# Altium schematic sheet TPS54622_Schematic.SchDoc
size A
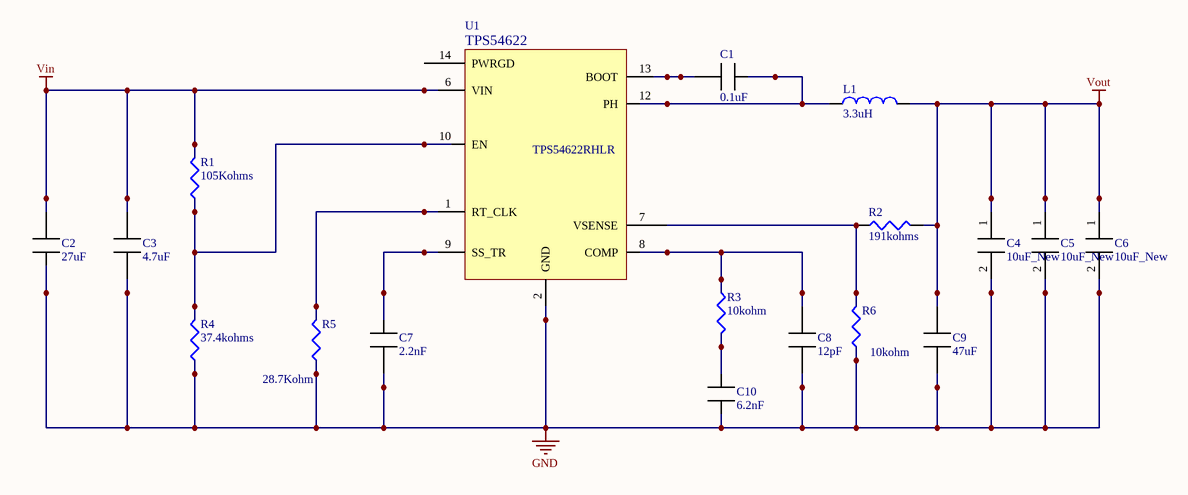
[diagram p0: TPS54622_Schematic.SchDoc]

## Parts
C1  0.1uF  [C/R0805]
C2  27uF  [CAPAE430X550N]
C3  4.7uF  [C/R0805]
C4  10uF_New  [CAPPM7343X310N]
C5  10uF_New  [CAPPM7343X310N]
C6  10uF_New  [CAPPM7343X310N]
C7  2.2nF  [C/R0805]
C8  12pF  [C/R0805]
C9  47uF  [C/R0805]
C10  6.2nF  [C/R0805]
L1  3.3uH  [C/R0805]
R1  105Kohms  [C/R0805]
R2  191kohms  [C/R0805]
R3  10kohm  [C/R0805]
R4  37.4kohms  [C/R0805]
R5  28.7Kohm  [C/R0805]
R6  10kohm  [C/R0805]
U1  TPS54622RHLR  [QFN50P350X350X100-15N]

## Nets
GND: C2.1 C3.1 C4.2 C5.2 C6.2 C7.1 C8.2 C9.1 C10.1 R4.1 R5.1 R6.1 U1.2(GND)
Vin: C2.2 C3.2 R1.2 U1.6(VIN)
Vout: C4.1 C5.1 C6.1 C9.2 L1.2 R2.2
NetC1_1: C1.1 U1.13(BOOT)
NetC1_2: C1.2 L1.1 U1.12(PH)
NetC7_2: C7.2 U1.9(SS_TR)
NetC8_1: C8.1 R3.1 U1.8(COMP)
NetC10_2: C10.2 R3.2
NetR1_1: R1.1 R4.2 U1.10(EN)
NetR2_1: R2.1 R6.2 U1.7(VSENSE)
NetR5_2: R5.2 U1.1(RT_CLK)

Not connected (* = marked no-connect by the designer): U1 14(PWRGD)

## Notes on the sheet
- (in symbol TPS54622RHLR) TPS54622

## Library data of the parts
C1 = C0805C104Z5VACTU: KEMET         C0805C104Z5VACTU.             CERAMIC CAPACITOR, 0.1UF, 50V, Y5V, +80,-20%, 0805; Ceramic Capacitor Case: 0805 [2012 Metric]; Capacitance: 0.1µF; Capacitance Tolerance: +80%, -20%; Product Range: C Series; SVHC: No SVHC (15-Jun-2015); Supplier 1: Digi-Key; Manufacturer: KEMET; Manufacturer Part Number: C0805C104Z5VACTU; Stock 1: 1249727; Pricing 1: 1=0.1, 10=0.057, 100=0.0254, 500=0.0182, 1000=0.0143 (USD); Voltage Rating: 50V; Dielectric Characteristic: Y5V; Packaging: Cut Tape; Operating Temperature Min: -30°C; Operating Temperature Max: 85°C; Automotive Qualification Standard: -; MSL: MSL 1 - Unlimited; ComponentLink1URL: http://www.alliedelec.com/m/d/9bfe7773041ffe9d406e68bc7b377fdd.pdf?src-supplier=Allied+Electronics; ComponentLink1Description: http://www.alliedelec.com/m/d/9bfe7773041ffe9d406e68bc7b377fdd.pdf?src-supplier=Allied+Electronics; ComponentLink2URL: https://www.verical.com/server-webapp/html/getDatasheet?partID=37101&src-supplier=Verical; ComponentLink2Description: https://www.verical.com/server-webapp/html/getDatasheet?partID=37101&src-supplier=Verical; ComponentLink3URL: https://www.verical.com/server-webapp/html/getDatasheet?partID=321176&src-supplier=Verical; ComponentLink3Description: https://www.verical.com/server-webapp/html/getDatasheet?partID=321176&src-supplier=Verical; ComponentLink4URL: http://www.farnell.com/datasheets/2123124.pdf?src-supplier=Element14; ComponentLink4Description: http://www.farnell.com/datasheets/2123124.pdf?src-supplier=Element14
C2 = 25SVPF27MX: CAP ALUM POLY 27UF 20% 25V SMD; Manufacturer: Panasonic; SVHC: To Be Advised; Product Range: PANASONIC - SVPF Series; Capacitance: 27µF; Capacitor Case Style: Radial Can - SMD; ESR: 0.04ohm; Ripple Current AC: 2.45A; Life Time @ Temperature: 5000 hours @ 105°C; Supplier 1: Digi-Key; Manufacturer Part Number: 25SVPF27MX; Stock 1: 1154; Pricing 1: 1=1.02, 10=0.809, 100=0.6065, 500=0.4583 (USD); Capacitance Tolerance: ± 20%; Voltage Rating: 25V; Diameter: 5mm; Height: 5.9mm; Packaging: Cut Tape; Operating Temperature Min: -55°C; Operating Temperature Max: 105°C; ComponentLink1URL: http://www.mouser.com/ds/2/315/AAB8000C177-947360.pdf?src-supplier=Mouser; ComponentLink1Description: http://www.mouser.com/ds/2/315/AAB8000C177-947360.pdf?src-supplier=Mouser; ComponentLink2URL: http://www.farnell.com/datasheets/1734360.pdf?src-supplier=Element14; ComponentLink2Description: http://www.farnell.com/datasheets/1734360.pdf?src-supplier=Element14; ComponentLink3URL: http://www.alliedelec.com/m/d/9b7b01c855a68cc875be7e3560c8e95f.pdf?src-supplier=Allied+Electronics; ComponentLink3Description: http://www.alliedelec.com/m/d/9b7b01c855a68cc875be7e3560c8e95f.pdf?src-supplier=Allied+Electronics; ComponentLink4URL: http://www.farnell.com/datasheets/2059634.pdf?src-supplier=Farnell; ComponentLink4Description: http://www.farnell.com/datasheets/2059634.pdf?src-supplier=Farnell
C3 = CC0805ZRY5V6BB475: CAP CER 4.7UF 10V Y5V 0805; Manufacturer: Yageo; Product Training Modules: Multilayer Ceramic Capacitors High Capacitance MLCCs; Featured Product: Yageo - High Capacitance MLCC; Capacitance: 4.7µF; Tolerance: -20%, +80%; Temperature Coefficient: Y5V (F); Online Catalog: CC Series; Other Names: 311-1371-6; Supplier 1: Digi-Key; Manufacturer Part Number: CC0805ZRY5V6BB475; Stock 1: 117685; Pricing 1: 1=0.19, 10=0.132, 100=0.0667, 500=0.0456, 1000=0.0404 (USD); Standard Package: 1; Category: Capacitors; Family: Ceramic Capacitors; Series: CC; Packaging: Digi-Reel®; Voltage - Rated: 10V; Mounting Type: Surface Mount, MLCC; Operating Temperature: -30°C ~ 85°C; Applications: General Purpose; Ratings: -; Package / Case: 0805 (2012 Metric); Size / Dimension: 0.079" L x 0.049" W (2.00mm x 1.25mm); Height - Seated (Max): -; Thickness (Max): 0.033" (0.85mm); Lead Spacing: -; Features: -; Lead Style: -; ComponentLink1URL: http://www.yageo.com/documents/recent/UPY-GPHC_Y5V_6.3V-to-50V_8.pdf?src-supplier=Digi-Key; ComponentLink1Description: http://www.yageo.com/documents/recent/UPY-GPHC_Y5V_6.3V-to-50V_8.pdf?src-supplier=Digi-Key; ComponentLink2URL: https://www.verical.com/server-webapp/html/getDatasheet?partID=251807&src-supplier=Verical; ComponentLink2Description: https://www.verical.com/server-webapp/html/getDatasheet?partID=251807&src-supplier=Verical; ComponentLink3URL: http://www.yageo.com/documents/recent/UPY-GPHC_Y5V_6.3V-to-50V_5.pdf?src-supplier=Avnet; ComponentLink3Description: http://www.yageo.com/documents/recent/UPY-GPHC_Y5V_6.3V-to-50V_5.pdf?src-supplier=Avnet; ComponentLink4URL: http://www.yageo.com/documents/recent/UPY-GPHC_Y5V_6.3V-to-50V_5.pdf?src-supplier=Avnet+Europe; ComponentLink4Description: http://www.yageo.com/documents/recent/UPY-GPHC_Y5V_6.3V-to-50V_5.pdf?src-supplier=Avnet+Europe; ComponentLink5URL: http://www.farnell.com/datasheets/1132289.pdf?src-supplier=Element14; ComponentLink5Description: http://www.farnell.com/datasheets/1132289.pdf?src-supplier=Element14; ComponentLink6URL: http://www.mouser.com/ds/2/447/Yageo_UPY-GP_NP0_16V-to-50V_9-358835.pdf?src-supplier=Mouser; ComponentLink6Description: http://www.mouser.com/ds/2/447/Yageo_UPY-GP_NP0_16V-to-50V_9-358835.pdf?src-supplier=Mouser; ComponentLink7URL: http://www.yageo.com/documents/recent/UPY-GPHC_Y5V_6.3V-to-50V_5_revised.pdf?src-supplier=Future+Electronics; ComponentLink7Description: http://www.yageo.com/documents/recent/UPY-GPHC_Y5V_6.3V-to-50V_5_revised.pdf?src-supplier=Future+Electronics
C4-C6 = T495D106M035ATE125: CAP TANT 10UF 35V 20% 2917; Manufacturer: KEMET; Product Range: KEMET - T495 Series; Capacitance: 10µF; Capacitor Case Style: 2917 ^7343 Metric]; ESR: 0.125ohm; Supplier 1: Digi-Key; Manufacturer Part Number: T495D106M035ATE125; Stock 1: 5675; Pricing 1: 1=1.79, 10=1.449, 100=1.1066 (USD); Packaging: Full Reel; Capacitance Tolerance: ± 20%; Voltage Rating: 35V; Operating Temperature Max: 125°C; Operating Temperature Min: -55°C; ComponentLink1URL: https://www.verical.com/server-webapp/html/getDatasheet?partID=44813&src-supplier=Verical; ComponentLink1Description: https://www.verical.com/server-webapp/html/getDatasheet?partID=44813&src-supplier=Verical; ComponentLink2URL: http://www.farnell.com/datasheets/1761160.pdf?src-supplier=Element14; ComponentLink2Description: http://www.farnell.com/datasheets/1761160.pdf?src-supplier=Element14; ComponentLink3URL: http://www.farnell.com/datasheets/1744560.pdf?src-supplier=Element14; ComponentLink3Description: http://www.farnell.com/datasheets/1744560.pdf?src-supplier=Element14
C7 = C0805C222K5RAC: Cap Ceramic 0.0022uF 50V X7R 10% Pad SMD 0805 125C Bulk; Manufacturer: KEMET; Construction form: 0805; Rated voltage: 50VDC; Supplier 1: Mouser; Manufacturer Part Number: C0805C222K5RAC; Stock 1: 148000; Pricing 1: 4000=0.009, 8000=0.008, 24000=0.007, 48000=0.006 (USD); Capacitance: 2.2nF; Capacitance tolerance: ±10%; Ceramic type: X7R; Temperature range: -55...+125°C; ComponentLink1URL: https://www1.elfa.se/data1/wwwroot/assets/datasheets/slCeramic-Chip-Condensers_e.pdf?src-supplier=Distrelec; ComponentLink1Description: https://www1.elfa.se/data1/wwwroot/assets/datasheets/slCeramic-Chip-Condensers_e.pdf?src-supplier=Distrelec
C8 = CC0805JRNPO9BN120: CAP CER 12PF 50V C0G/NPO 0805; Manufacturer: Yageo; Product Training Modules: Multilayer Ceramic Capacitors; Catalog Drawings: CC_0805_0.6; Featured Product: Commodity Multilayer Ceramic Capacitors – CC Series; Tolerance: ±5%; Temperature Coefficient: C0G, NP0; Online Catalog: CC Series; Other Names: 311-1100-6 311-1296-6 311-1296-6-ND; Supplier 1: Digi-Key; Manufacturer Part Number: CC0805JRNPO9BN120; Stock 1: 77774; Pricing 1: 1=0.11, 10=0.079, 100=0.0351, 500=0.0251, 1000=0.0197 (USD); Standard Package: 1; Category: Capacitors; Family: Ceramic Capacitors; Series: CC; Packaging: Digi-Reel®; Capacitance: 12pF; Voltage - Rated: 50V; Mounting Type: Surface Mount, MLCC; Operating Temperature: -55°C ~ 125°C; Applications: General Purpose; Ratings: -; Package / Case: 0805 (2012 Metric); Size / Dimension: 0.079" L x 0.049" W (2.00mm x 1.25mm); Height - Seated (Max): -; Thickness (Max): 0.024" (0.60mm); Lead Spacing: -; Features: -; Lead Style: -; ComponentLink1URL: https://www.verical.com/server-webapp/html/getDatasheet?partID=38285&src-supplier=Verical; ComponentLink1Description: https://www.verical.com/server-webapp/html/getDatasheet?partID=38285&src-supplier=Verical; ComponentLink2URL: http://www.yageo.com/documents/recent/UPY-GP_NP0_16V-to-50V_16.pdf?src-supplier=Digi-Key; ComponentLink2Description: http://www.yageo.com/documents/recent/UPY-GP_NP0_16V-to-50V_16.pdf?src-supplier=Digi-Key; ComponentLink3URL: http://www.yageo.com/documents/recent/UPY-GP_NP0_16V-to-50V_8.pdf?src-supplier=Avnet; ComponentLink3Description: http://www.yageo.com/documents/recent/UPY-GP_NP0_16V-to-50V_8.pdf?src-supplier=Avnet; ComponentLink4URL: http://www.yageo.com/documents/recent/UPY-GP_NP0_16V-to-50V_8.pdf?src-supplier=Avnet+Europe; ComponentLink4Description: http://www.yageo.com/documents/recent/UPY-GP_NP0_16V-to-50V_8.pdf?src-supplier=Avnet+Europe; ComponentLink5URL: https://produktinfo.conrad.com/datenblaetter/425000-449999/445317-da-01-en-KERKO_CHIP_0805_NP0_12pF_5Proz_50V_G.pdf?src-supplier=Conrad; ComponentLink5Description: https://produktinfo.conrad.com/datenblaetter/425000-449999/445317-da-01-en-KERKO_CHIP_0805_NP0_12pF_5Proz_50V_G.pdf?src-supplier=Conrad
C9 = GRM21BR60J476ME15K: 47µF 6.3V Ceramic Capacitor X5R 0805 (2012 Metric) 0.079" L x 0.049" W (2.00mm x 1.25mm); Manufacturer: Murata; Categories: Capacitors; Tolerance: ±20%; Supplier 1: Digi-Key; Manufacturer Part Number: GRM21BR60J476ME15K; Stock 1: 16666; Pricing 1: 1=0.48, 10=0.339, 100=0.2236, 500=0.1656, 1000=0.1408, 2500=0.1325, 5000=0.1242 (USD); Series: GRM; Packaging: Tape & Reel (TR); Part Status: Not For New Designs; Capacitance: 47µF; Voltage - Rated: 6.3V; Temperature Coefficient: X5R; Operating Temperature: -55°C ~ 85°C; Features: -; Ratings: -; Applications: General Purpose; Mounting Type: Surface Mount, MLCC; Package / Case: 0805 (2012 Metric); Size / Dimension: 0.079 L x 0.049 W (2.00mm x 1.25mm); Height - Seated (Max): -; Thickness (Max): 0.057 (1.45mm); Lead Spacing: -; Lead Style: -; ComponentLink1URL: http://www.mouser.com/ds/2/281/c02e-2905.pdf?src-supplier=Mouser; ComponentLink1Description: http://www.mouser.com/ds/2/281/c02e-2905.pdf?src-supplier=Mouser; ComponentLink2URL: https://search.murata.co.jp/Ceramy/image/img/A01X/G101/ENG/GRM21BR60J476ME15-01.pdf?src-supplier=Digi-Key; ComponentLink2Description: https://search.murata.co.jp/Ceramy/image/img/A01X/G101/ENG/GRM21BR60J476ME15-01.pdf?src-supplier=Digi-Key
C10 = GRM2195C1H622JA01D: CAP CER 6200PF 50V C0G/NP0 0805; Manufacturer: Murata; Rad Hard: No; Capacitance Value: 0.0062 uF; Voltage: 50 Vdc; Tolerance: 5 %; Dielectric: C0G; Product Length: 2 mm; Product Height: 0.85 mm; Product Depth: 1.25 mm; Supplier 1: Digi-Key; Manufacturer Part Number: GRM2195C1H622JA01D; Stock 1: 21992; Pricing 1: 1=0.32, 10=0.219, 100=0.124, 500=0.0875, 1000=0.0766 (USD); Packaging: Tape & Reel; Package/Case: 0805; Mounting: Surface Mount; Operating Temperature: -55 to 125 °C; Construction: Flat; Category: Capacitor Ceramic Multilayer; ComponentLink1URL: https://www.murata.com/~/media/webrenewal/support/library/catalog/products/capacitor/mlcc/c02e.ashx?la=en-us&src-supplier=Digi-Key; ComponentLink1Description: https://www.murata.com/~/media/webrenewal/support/library/catalog/products/capacitor/mlcc/c02e.ashx?la=en-us&src-supplier=Digi-Key; ComponentLink2URL: http://www.mouser.com/ds/2/281/c02e-2905.pdf?src-supplier=Mouser; ComponentLink2Description: http://www.mouser.com/ds/2/281/c02e-2905.pdf?src-supplier=Mouser
L1 = BRC2012T3R3MD: INDUCTOR, 3.3UH, 870MA, 20%, 300MHZ; Core Material:Ferrite; DC Current Rating:870mA; DC Resistance Max:0.17ohm; Inductance:3.3µH; Inductance Tolerance:± 20%; Inductor Case Style:0805; Lead Spacing:1mm; No. of Pins:2 ;RoHS Compliant: Yes; Manufacturer: Taiyo Yuden; EDA / CAD Models: Download from Accelerated Designs; Type: Wirewound; Inductance: 3.3µH; Current - Saturation: 800mA; Shielding: Unshielded; DC Resistance (DCR): 221 mOhm Max; Frequency - Test: 1MHz; Online Catalog: BR Series; Other Names: 587-2906-2 / BR C2012T3R3MD / LQ BR C2012T3R3MD; Supplier 1: Digi-Key; Manufacturer Part Number: BRC2012T3R3MD; Stock 1: 19368; Pricing 1: 1=0.35, 10=0.308, 100=0.2119, 500=0.1811, 1000=0.1387 (USD); Standard Package: 2,000; Category: Inductors, Coils, Chokes; Family: Fixed Inductors; Series: BR; Packaging: Tape & Reel (TR); Tolerance: ±20%; Current Rating: 870mA; Frequency - Self Resonant: 300MHz; Operating Temperature: -40°C ~ 105°C; Mounting Type: Surface Mount; Package / Case: 0805 (2012 Metric); Size / Dimension: 0.079" L x 0.049" W (2.00mm x 1.25mm); Height - Seated (Max): 0.055" (1.40mm); ComponentLink1URL: https://www.verical.com/server-webapp/html/getDatasheet?partID=639073&src-supplier=Verical; ComponentLink1Description: https://www.verical.com/server-webapp/html/getDatasheet?partID=639073&src-supplier=Verical; ComponentLink2URL: http://www.yuden.co.jp/ut/product/category/inductor/BRC2012T3R3MD.pdf?src-supplier=Newark; ComponentLink2Description: http://www.yuden.co.jp/ut/product/category/inductor/BRC2012T3R3MD.pdf?src-supplier=Newark; ComponentLink3URL: http://ds.yuden.co.jp/TYCOMPAS/ut/detail.do?productNo=BRC2012T3R3MD&fileName=BRC2012T3R3MD_SS&mode=specSheetDownload&src-supplier=Digi-Key; ComponentLink3Description: http://ds.yuden.co.jp/TYCOMPAS/ut/detail.do?productNo=BRC2012T3R3MD&fileName=BRC2012T3R3MD_SS&mode=specSheetDownload&src-supplier=Digi-Key; ComponentLink4URL: http://documents.rs-components.com/techlib://itc_doclist_GB.htm?stockno=7557540&src-supplier=RSComponents; ComponentLink4Description: http://documents.rs-components.com/techlib://itc_doclist_GB.htm?stockno=7557540&src-supplier=RSComponents
R1 = ERA-6AEB1053V: RESISTOR, 0805, 105K, 0.1%, 0.125W; Manufacturer: Panasonic; Power Rating: 125mW; Resistor Case Style: 0805 [2012 Metric]; Resistor Element Material: Thin Film; Temperature Coefficient: ± 25ppm/°C; Voltage Rating: 100V; External Depth: 1.25mm; External Length / Height: 0.5mm; External Width: 2mm; No. of Pins: 2; Product Range: PANASONIC - ERA; Resistor Mounting: SMD; Supplier 1: Digi-Key; Manufacturer Part Number: ERA-6AEB1053V; Stock 1: 9772; Pricing 1: 1=0.36, 10=0.302, 100=0.1182, 1000=0.0495, 2500=0.0454 (USD); Resistance: 105kohm; Resistance Tolerance: ± 0.1%; Operating Temperature Max: 155°C; Operating Temperature Min: -55°C; Operating Temperature Range: -55°C to +155°C; Packaging: Reel; Series: ERA; ComponentLink1URL: http://uk.rs-online.com/webdocs/0eb1/0900766b80eb1d8c.pdf?src-supplier=RSComponents; ComponentLink1Description: http://uk.rs-online.com/webdocs/0eb1/0900766b80eb1d8c.pdf?src-supplier=RSComponents; ComponentLink2URL: http://www.farnell.com/datasheets/485442.pdf?src-supplier=Farnell; ComponentLink2Description: http://www.farnell.com/datasheets/485442.pdf?src-supplier=Farnell; ComponentLink3URL: http://industrial.panasonic.com/www-data/pdf/AOA0000/AOA0000CE26.pdf?src-supplier=Avnet+Europe; ComponentLink3Description: http://industrial.panasonic.com/www-data/pdf/AOA0000/AOA0000CE26.pdf?src-supplier=Avnet+Europe; ComponentLink4URL: http://www.farnell.com/datasheets/485442.pdf?src-supplier=Element14; ComponentLink4Description: http://www.farnell.com/datasheets/485442.pdf?src-supplier=Element14; ComponentLink5URL: http://www.produktinfo.conrad.com/datenblaetter/1100000-1199999/001181353-da-01-en-WIDERSTAND_ERA_0805_105K_0_1__5000ST.pdf?src-supplier=Conrad; ComponentLink5Description: http://www.produktinfo.conrad.com/datenblaetter/1100000-1199999/001181353-da-01-en-WIDERSTAND_ERA_0805_105K_0_1__5000ST.pdf?src-supplier=Conrad
R2 = ERA-6AEB1913V: Res Thin Film 0805 191K Ohm 0.1% 1/8W 25ppm/C Molded SMD Punched Carrier T/R; Manufacturer: Panasonic; Power Rating: 125mW; Resistor Case Style: 0805 [2012 Metric]; Temperature Coefficient: ± 25ppm/°C; Voltage Rating: 100V; External Depth: 1.25mm; External Length / Height: 0.5mm; External Width: 2mm; No. of Pins: 2; Product Range: PANASONIC - ERA; Supplier 1: Digi-Key; Manufacturer Part Number: ERA-6AEB1913V; Stock 1: 6723; Pricing 1: 1=0.36, 10=0.302, 100=0.1182, 1000=0.0495, 2500=0.0454 (USD); Resistance: 191kohm; Resistance Tolerance: ± 0.1%; Resistor Element Material: Thin Film; Operating Temperature Max: 155°C; Operating Temperature Min: -55°C; Operating Temperature Range: -55°C to +155°C; Packaging: Reel; Resistor Mounting: SMD; Series: ERA; ComponentLink1URL: http://www.farnell.com/datasheets/485442.pdf?src-supplier=Farnell; ComponentLink1Description: http://www.farnell.com/datasheets/485442.pdf?src-supplier=Farnell; ComponentLink2URL: http://uk.rs-online.com/webdocs/0eb1/0900766b80eb1d8c.pdf?src-supplier=RSComponents; ComponentLink2Description: http://uk.rs-online.com/webdocs/0eb1/0900766b80eb1d8c.pdf?src-supplier=RSComponents; ComponentLink3URL: http://industrial.panasonic.com/www-data/pdf/AOA0000/AOA0000CE26.pdf?src-supplier=Avnet; ComponentLink3Description: http://industrial.panasonic.com/www-data/pdf/AOA0000/AOA0000CE26.pdf?src-supplier=Avnet; ComponentLink4URL: http://www.produktinfo.conrad.com/datenblaetter/1100000-1199999/001181370-da-01-en-WIDERSTAND_ERA_0805_191K_0_1__5000ST.pdf?src-supplier=Conrad; ComponentLink4Description: http://www.produktinfo.conrad.com/datenblaetter/1100000-1199999/001181370-da-01-en-WIDERSTAND_ERA_0805_191K_0_1__5000ST.pdf?src-supplier=Conrad
R3 R6 = LTR10EZPJ103: RES SMD 10K OHM 1/4W 0805 WIDE; Manufacturer: Rohm; EDA / CAD Models: Download from Accelerated Designs; Tolerance: ±5%; Power (Watts): 0.25W, 1/4W; Temperature Coefficient: ±200ppm/°C; Online Catalog: LTR10 Series; Other Names: RHM10KBUTR; Supplier 1: Digi-Key; Manufacturer Part Number: LTR10EZPJ103; Stock 1: 1415; Pricing 1: 1=0.15, 10=0.131, 100=0.0502, 1000=0.0221, 2500=0.0191 (USD); Standard Package: 5,000; Category: Resistors; Family: Chip Resistor - Surface Mount; Series: LTR; Packaging: Tape & Reel (TR); Resistance (Ohms): 10k; Composition: Thick Film; Features: Automotive AEC-Q200, Pulse Withstanding; Operating Temperature: -55°C ~ 155°C; Package / Case: Wide 0805 (2012 Metric), 0508; Supplier Device Package: 0805 (2012 Metric); Size / Dimension: 0.047" L x 0.079" W (1.20mm x 2.00mm); Height: 0.026" (0.65mm); Number of Terminations: 2; ComponentLink1URL: http://www.rohm.com/web/global/datasheet/LTR100JZPD/ltr-e?src-supplier=Digi-Key; ComponentLink1Description: http://www.rohm.com/web/global/datasheet/LTR100JZPD/ltr-e?src-supplier=Digi-Key
R4 = ERA6AEB3742V: Metal film resistor 37.4 kΩ SMD 0805 0.125 W; Manufacturer: Panasonic; Resistor Terminals: –; Power Rating: 125mW; Resistance Tolerance: ± 0.1%; Resistor Case Style: 0805 [2012 Metric]; Resistor Element Material: Thin Film; Temperature Coefficient: ± 25ppm/°C; Voltage Rating: 100V; External Depth: 1.25mm; External Length / Height: 0.5mm; External Width: 2mm; No. of Pins: 2; Product Range: PANASONIC - ERA; Supplier 1: Digi-Key; Manufacturer Part Number: ERA6AEB3742V; Stock 1: 34770; Pricing 1: 1=0.36, 10=0.302, 100=0.1182, 1000=0.0495, 2500=0.0454 (USD); MSL: –; SVHC: –; Resistance: 37.4kohm; Operating Temperature Max: 155°C; Operating Temperature Min: -55??C; Operating Temperature Range: -55°C to +155°C; Packaging: Reel; Resistor Mounting: SMD; Series: ERA; ComponentLink1URL: http://www.farnell.com/datasheets/485442.pdf?src-supplier=Farnell; ComponentLink1Description: http://www.farnell.com/datasheets/485442.pdf?src-supplier=Farnell; ComponentLink2URL: http://uk.rs-online.com/webdocs/0eb1/0900766b80eb1d8c.pdf?src-supplier=RSComponents; ComponentLink2Description: http://uk.rs-online.com/webdocs/0eb1/0900766b80eb1d8c.pdf?src-supplier=RSComponents; ComponentLink3URL: http://industrial.panasonic.com/www-data/pdf/AOA0000/AOA0000CE26.pdf?src-supplier=Avnet+Europe; ComponentLink3Description: http://industrial.panasonic.com/www-data/pdf/AOA0000/AOA0000CE26.pdf?src-supplier=Avnet+Europe; ComponentLink4URL: https://produktinfo.conrad.com/datenblaetter/450000-474999/458559-da-01-en-WIDERSTAND_0805_ERA.pdf?src-supplier=Conrad; ComponentLink4Description: https://produktinfo.conrad.com/datenblaetter/450000-474999/458559-da-01-en-WIDERSTAND_0805_ERA.pdf?src-supplier=Conrad
R5 = RG2012P-2872-B-T5: RES SMD 28.7K OHM 0.1% 1/8W 0805; Manufacturer: Susumu; Resistance: 28.7 kOhms; Power Rating: 100 mW; Temperature Coefficient: 25 PPM / C; Voltage Rating: 100 V; Case Height: 0.4 mm; Case Length: 2 mm; Case Width: 1.25 mm; Supplier 1: Digi-Key; Manufacturer Part Number: RG2012P-2872-B-T5; Stock 1: 18308; Pricing 1: 1=0.41, 10=0.318, 100=0.1336, 1000=0.0737, 2500=0.0691 (USD); Termination Style: SMD/SMT; Dimensions: 1.25 mm W x 2 mm L x 0.4 mm H; Product Category: Thin Film Resistors - SMD; RoHS: Details; Tolerance: 0.1 %; Case Code - in: 0805; Case Code - mm: 2012; Operating Temperature Range: - 55 C to + 155 C; Brand: Susumu; Package / Case: 0805 (2012 metric); Packaging: Reel; Product: Precision Resistors Thin Film SMD; Series: RG; Factory Pack Quantity: 5000; ComponentLink1URL: http://www.susumu.co.jp/common/pdf/n_catalog_partition01_en.pdf?src-supplier=Digi-Key; ComponentLink1Description: http://www.susumu.co.jp/common/pdf/n_catalog_partition01_en.pdf?src-supplier=Digi-Key; ComponentLink2URL: http://www.susumu-usa.com/pdf/RG_RM_RGH_DATASHEET.pdf?src-supplier=Future+Electronics; ComponentLink2Description: http://www.susumu-usa.com/pdf/RG_RM_RGH_DATASHEET.pdf?src-supplier=Future+Electronics
U1 = TPS54622RHLR: IC REG BUCK ADJ 6A SYNC 14QFN; Manufacturer: Texas Instruments; Product Training Modules: Telecom Point of Load Solutions; Featured Product: WEBENCH Design Center; Output Type: Adjustable; Number of Outputs: 1; Voltage - Output: 0.6 V ~ 15 V; Voltage - Input: 4.5 V ~ 17 V; PWM Type: Current Mode; Frequency - Switching: 200kHz ~ 1.6MHz; Synchronous Rectifier: Yes; Dynamic Catalog: Buck (Step-Down) IC; Other Names: 296-29204-2 / TPS54622RHLR-ND; Supplier 1: Digi-Key; Manufacturer Part Number: TPS54622RHLR; Stock 1: 16152; Pricing 1: 1=4.68, 10=4.207, 100=3.2698, 500=2.828, 1000=2.3508 (USD); Standard Package: 3,000; Category: Integrated Circuits (ICs); Family: PMIC - Voltage Regulators - DC DC Switching Regulators; Series: SWIFT™; Type: Step-Down (Buck); Current - Output: 6A; Operating Temperature: -40°C ~ 150°C; Mounting Type: Surface Mount; Package / Case: 14-VFQFN Exposed Pad; Packaging: Tape & Reel (TR); Supplier Device Package: 14-QFN Exposed Pad (3.5x3.5); ComponentLink1URL: http://www.ti.com/lit/ds/symlink/tps54622.pdf?src-supplier=Digi-Key; ComponentLink1Description: http://www.ti.com/lit/ds/symlink/tps54622.pdf?src-supplier=Digi-Key; ComponentLink2URL: http://www.ti.com/general/docs/lit/getliterature.tsp?genericPartNumber=TPS54622&&fileType=pdf&src-supplier=Avnet; ComponentLink2Description: http://www.ti.com/general/docs/lit/getliterature.tsp?genericPartNumber=TPS54622&&fileType=pdf&src-supplier=Avnet; ComponentLink3URL: http://www.ti.com/lit/gpn/tps54622?src-supplier=Mouser; ComponentLink3Description: http://www.ti.com/lit/gpn/tps54622?src-supplier=Mouser